# Altium schematic sheet Pheripherials.SchDoc
size A4; SheetNumber: 2; SheetTotal: 2
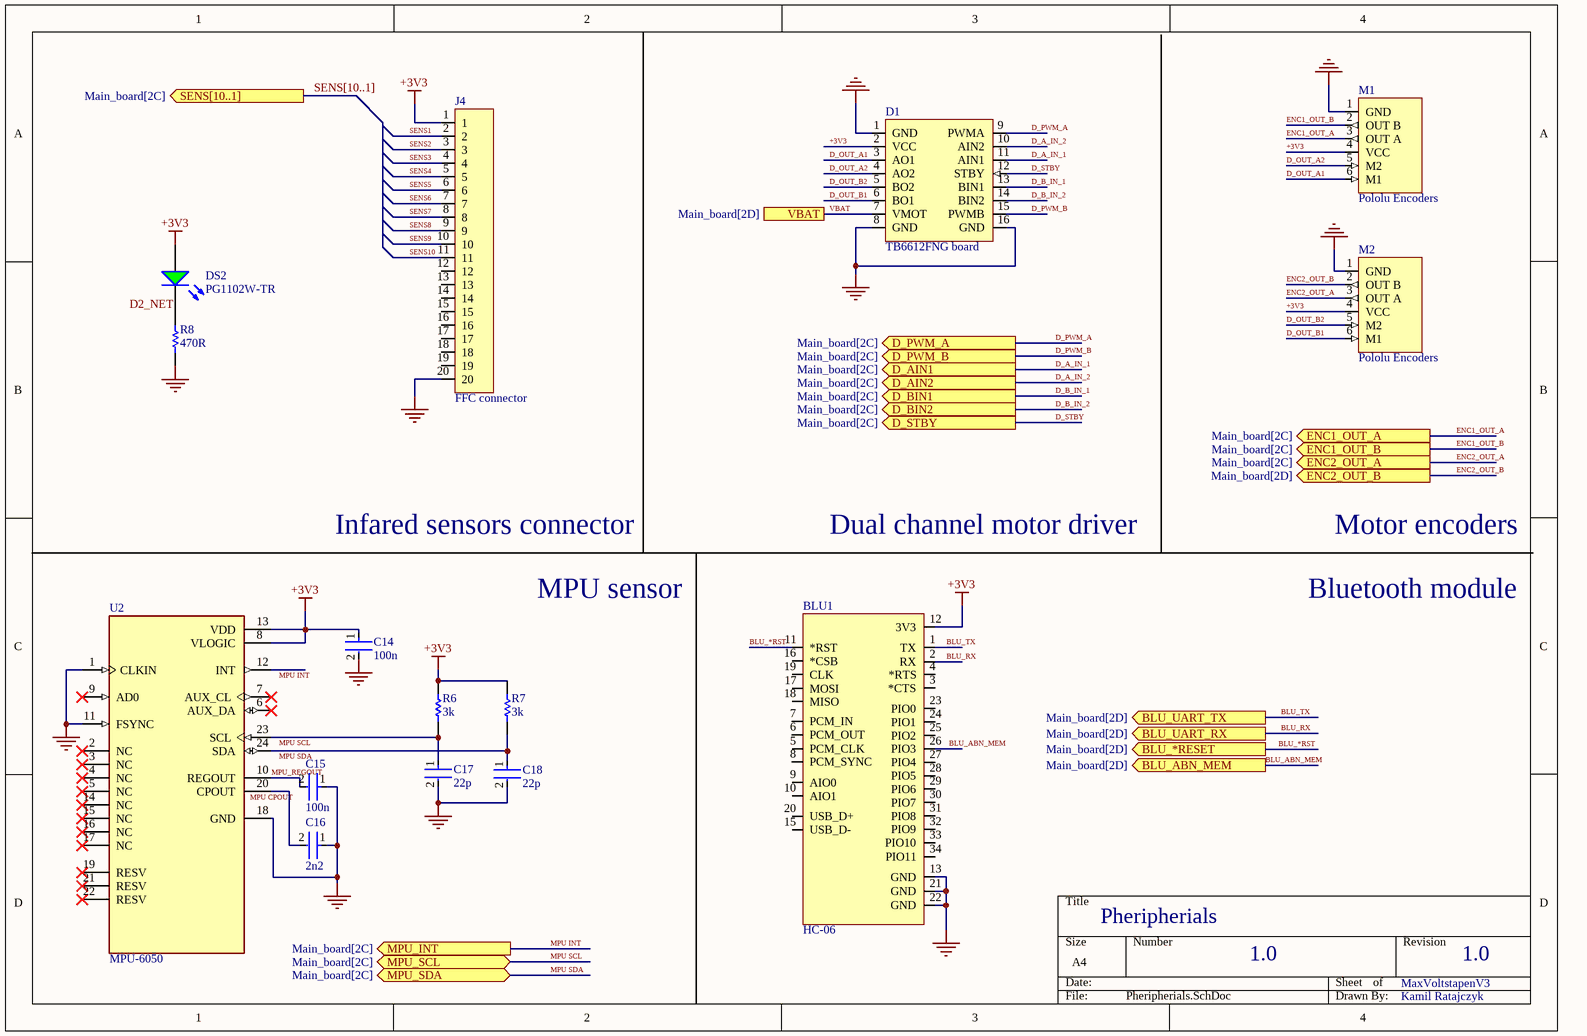
[diagram p0: Pheripherials.SchDoc]

## Parts
BLU1  HC-06
C14  100n  [FP-CC0805-0_85-MFG]
C15  100n  [FP-CC0805-0_85-MFG]
C16  2n2  [FP-CC0805-0_85-MFG]
C17  22p  [FP-CC0805-0_85-MFG]
C18  22p  [FP-CC0805-0_85-MFG]
D1  TB6612FNG board  [TB6612FNG board footprint]
DS2  PG1102W-TR  [STEC-1102W_V]
J4  FFC connector  [GCT_FFC2B35-20-G_REVA2]
M1  Pololu Encoders  [Encoders Pololu footprint]
M2  Pololu Encoders  [Encoders Pololu footprint]
R6  3k  [RESC2013X60X35NL10T20]
R7  3k  [RESC2013X60X35NL10T20]
R8  470R  [RESC2013X60X35NL10T20]
U2  MPU-6050  [QFN50P400X400X95-24N]

## Ports
BLU_*RESET (out, see Main_board[2D]), BLU_ABN_MEM (out, see Main_board[2D]), BLU_UART_RX (out, see Main_board[2D]), BLU_UART_TX (out, see Main_board[2D]), D_AIN1 (out, see Main_board[2C]), D_AIN2 (out, see Main_board[2C]), D_BIN1 (out, see Main_board[2C]), D_BIN2 (out, see Main_board[2C]), D_PWM_A (out, see Main_board[2C]), D_PWM_B (out, see Main_board[2C]), D_STBY (out, see Main_board[2C]), ENC1_OUT_A (out, see Main_board[2C]), ENC1_OUT_B (out, see Main_board[2C]), ENC2_OUT_A (out, see Main_board[2C]), ENC2_OUT_B (out, see Main_board[2D]), MPU_INT (out, see Main_board[2C]), MPU_SCL (bidir, see Main_board[2C]), MPU_SDA (bidir, see Main_board[2C]), SENS[10..1] (out, see Main_board[2C]), VBAT (see Main_board[2D])

## Nets
+3V3: BLU1.12(3V3) C14.1 D1.2(VCC) DS2.1(A) J4.1 M1.4(VCC) M2.4(VCC) R6.1 R7.1 U2.8(VLOGIC) U2.13(VDD)
GND: BLU1.13(GND) BLU1.21(GND) BLU1.22(GND) C14.2 C15.1 C16.1 C17.2 C18.2 D1.1(GND) D1.8(GND) D1.16(GND) J4.20 M1.1(GND) M2.1(GND) R8.2 U2.1(CLKIN) U2.11(FSYNC) U2.18(GND)
BLU_*RST: BLU1.11(*RST) ; port BLU_*RESET
BLU_ABN_MEM: BLU1.26(PIO3) ; port BLU_ABN_MEM
BLU_RX: BLU1.2(RX) ; port BLU_UART_RX
BLU_TX: BLU1.1(TX) ; port BLU_UART_TX
D2_NET: DS2.2(K) R8.1
D_A_IN_1: D1.11(AIN1) ; port D_AIN1
D_A_IN_2: D1.10(AIN2) ; port D_AIN2
D_B_IN_1: D1.13(BIN1) ; port D_BIN1
D_B_IN_2: D1.14(BIN2) ; port D_BIN2
D_OUT_A1: D1.3(AO1) M1.6(M1)
D_OUT_A2: D1.4(AO2) M1.5(M2)
D_OUT_B1: D1.6(BO1) M2.6(M1)
D_OUT_B2: D1.5(BO2) M2.5(M2)
D_PWM_A: D1.9(PWMA) ; port D_PWM_A
D_PWM_B: D1.15(PWMB) ; port D_PWM_B
D_STBY: D1.12(STBY) ; port D_STBY
ENC1_OUT_A: M1.3(OUT_A) ; port ENC1_OUT_A
ENC1_OUT_B: M1.2(OUT_B) ; port ENC1_OUT_B
ENC2_OUT_A: M2.3(OUT_A) ; port ENC2_OUT_A
ENC2_OUT_B: M2.2(OUT_B) ; port ENC2_OUT_B
MPU INT: U2.12(INT) ; port MPU_INT
MPU SCL: C17.1 R6.2 U2.23(SCL) ; port MPU_SCL
MPU SDA: C18.1 R7.2 U2.24(SDA) ; port MPU_SDA
MPU_REGOUT: C15.2 U2.10(REGOUT)
SENS1: J4.2
SENS2: J4.3
SENS3: J4.4
SENS4: J4.5
SENS5: J4.6
SENS6: J4.7
SENS7: J4.8
SENS8: J4.9
SENS9: J4.10
SENS10: J4.11
VBAT: D1.7(VMOT) ; port VBAT
NetC16_2: C16.2 U2.20(CPOUT)

Not connected (* = marked no-connect by the designer): BLU1 3(*CTS) 4(*RTS) 5(PCM_CLK) 6(PCM_OUT) 7(PCM_IN) 8(PCM_SYNC) 9(AIO0) 10(AIO1) 15(USB_D-) 16(*CSB) 17(MOSI) 18(MISO) 19(CLK) 20(USB_D+) 23(PIO0) 24(PIO1) 25(PIO2) 27(PIO4) 28(PIO5) 29(PIO6) 30(PIO7) 31(PIO8) 32(PIO9) 33(PIO10) 34(PIO11); J4 12 13 14 15 16 17 18 19; U2 2(NC)* 3(NC)* 4(NC)* 5(NC)* 6(AUX_DA)* 7(AUX_CL)* 9(AD0)* 14(NC)* 15(NC)* 16(NC)* 17(NC)* 19(RESV)* 21(RESV)* 22(RESV)*

## Buses and harness runs
bus SENS[10..1] = port SENS[10..1]

## Notes on the sheet
- Infared sensors connector
- Dual channel motor driver
- Motor encoders
- MPU sensor
- Bluetooth module
- Pheripherials
- 1.0
- MaxVoltstapenV3
- Kamil Ratajczyk
- Labels drawn without touching a wire or pin: MPU CPOUT

## Library data of the parts
BLU1 = BLUETOOTH-SERIAL-HC-06
C14-C18 = CMP-1036-04402-6: CAP CER 0.1UF 16V X7R 0805; Manufacturer Part Number: CC0805KRX7R7BB104; Manufacturer: Yageo; Material: Ceramic; Tolerance: 0.1; Capacitance: 100 nF; Value: 100 nF; Temperature: -30°C to +85°C; Lead Free: Yes; Footprint Url: http://www.yageo.com/exep/pages/download/literatures/UPY-C_GEN_24.pdf; Voltage Rating: 16 V; Package: CC0805-0.85; RoHS: TRUE; Digikey Description: CAP CER 0.1UF 16V X7R 0805; Category: Cap; Octopart: https://octopart.com/cc0805krx7r7bb104-yageo-39467769; Device Class L3: Ceramic Capacitors; ComponentLink2URL: http://www.yageo.com/documents/recent/UPY-GPHC_Y5V_6.3V-to-50V_8.pdf; Temperature Range Low: -30°C; Mouser Description: Multilayer Ceramic Capacitors MLCC - SMD/SMT 100nF 16V X7R 10%; Automotive: No; Device Class L2: Capacitors; Height: 0.95mm; ComponentLink2Description: Datasheet; Temperature Characteristic: X7R; Ipc Land Pattern Name: CAPC200125X85; Device Class L1: Passive Components; Temperature Range High: +85°C
DS2 = CMP-2000-06890-1: Green LED, 567 nm, 2.1 V, 30 mA, -30 to 85 degC, 2-Pin SMD, RoHS, Tape and Reel; Manufacturer: Stanley Electric; Viewing Angle: 69/85deg; High Brightness: No; Number of  Elements: 1; Peak Wavelength: 560nm; Forward Current: 30mA; Test Current (It): 20mA; Main Category: ChipLED; Type: Uni-Color; Dominant Wave Length: 567nm; Power Dissipation: 75W; Lum Intensity: 12mcd; Shape Type: Rectangular; Chip Material: GaP; Reverse Voltage: 4V; Product Depth (mm): 1.5mm; Forward Voltage: 2.5V; Product Length (mm): 3mm; DELETED: Compliant; Emitting Color: YellowGreen; Operating Temp Range: -30Cto85C; Datasheet URL: http://media.digikey.com/pdf/Data%20Sheets/Stanley%20Electric%20PDFs/1102W_Series.pdf; Packaging: TapeandReel; Package Reference: 1102W; Manufacturer URL: http://www.stanley-electric.com/; Package Description: 2-Pin Surface Mounted Device , Body 3 x 1.5 mm; Rad Hardened: No; Mounting Technology: SurfaceMount; Package Type: SMD; Operating Temperature Classification: Commercial; Product Height (mm): 1.5mm; Pin Count: 2; Lens Dimensions: 2x1.5x0.9mm; Datasheet Version: 08/2007; Mounting: SurfaceMount; Luminous Intensity: 12mcd
J4 = FFC2B35-20-G
R6-R8 = CMP-1659-00013-4: Chip Resistor, 10 KOhm, +/- 1%, 0.125 W, -55 to 155 degC, 0805 (2012 Metric), RoHS, Tape and Reel; Manufacturer: Yageo; Voltage Rating: 150 V; Mount: Surface Mount; ComponentLink1Description: Manufacturer URL; ComponentLink2URL: http://www.yageo.com/documents/recent/PYu-RC_Group_51_RoHS_L_04.pdf; Pins: 2; Length: 2 mm; Min Operating Temperature: -55 degC; Height: 0.5 mm; Mounting Technology: Surface Mount; RoHSCompliant: true; REACH SVHC: No SVHC; ComponentLink1URL: http://www.yageo.com/; Max Operating Temperature: 155 degC; PackageReference: 0805; DatasheetVersion: Rev. 4, 02/2016; Package Quantity: 5000; Packaging: Tape and Reel; ComponentLink2Description: Datasheet; PackageDescription: 2-Pin Surface Mounted Device, Body 2 x 1.25 mm
U2 = MPU-6050: MPU-6050 series Accelerometer, Gyroscope, 3 Axis Sensor Evaluation Board; MF: TDK InvenSense; SnapEDA_Link: https://www.snapeda.com/parts/MPU-6050/TDK+InvenSense/view-part/?ref=snap; Package: QFN-24 InvenSense; Value: *; MP: MPU-6050; Check_prices: https://www.snapeda.com/parts/MPU-6050/TDK+InvenSense/view-part/?ref=eda